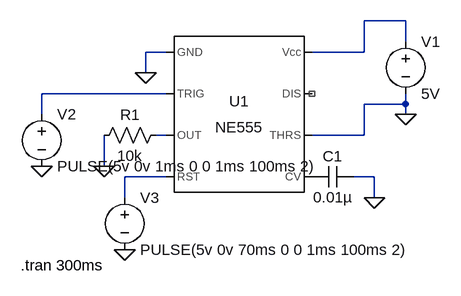
[diagram p0: schematic Bistable.asc]
Bistable.asc, the LTspice schematic file:
Version 4
SHEET 1 880 680
WIRE 480 32 416 32
WIRE 480 64 480 32
WIRE 112 80 80 80
WIRE 416 80 416 32
WIRE 416 80 336 80
WIRE 80 112 80 80
WIRE 112 144 -80 144
WIRE 480 160 480 144
WIRE 480 160 416 160
WIRE -80 176 -80 144
WIRE 480 176 480 160
WIRE 112 208 96 208
WIRE 416 208 416 160
WIRE 416 208 336 208
WIRE 16 256 16 208
WIRE 112 272 48 272
WIRE 432 272 400 272
WIRE 48 304 48 272
WIRE 432 304 432 272
FLAG 80 112 0
FLAG 480 176 0
FLAG -80 256 0
FLAG 48 384 0
FLAG 16 256 0
FLAG 432 304 0
SYMBOL Misc\\NE555 224 176 R0
SYMATTR InstName U1
SYMBOL voltage 480 48 R0
SYMATTR InstName V1
SYMATTR Value 5V
SYMBOL voltage -80 160 R0
WINDOW 123 0 0 Left 0
WINDOW 39 0 0 Left 0
SYMATTR InstName V2
SYMATTR Value PULSE(5v 0v 1ms 0 0 1ms 100ms 2)
SYMBOL voltage 48 288 R0
WINDOW 123 0 0 Left 0
WINDOW 39 0 0 Left 0
SYMATTR InstName V3
SYMATTR Value PULSE(5v 0v 70ms 0 0 1ms 100ms 2)
SYMBOL res 112 192 R90
WINDOW 0 0 56 VBottom 2
WINDOW 3 32 56 VTop 2
SYMATTR InstName R1
SYMATTR Value 10k
SYMBOL cap 400 256 R90
WINDOW 0 0 32 VBottom 2
WINDOW 3 32 32 VTop 2
SYMATTR InstName C1
SYMATTR Value 0.01µ
TEXT -112 408 Left 2 !.tran 300ms

The netlist it stands for:
* Bistable.asc
XU1 0 N002 N003 N004 P001 0 NC_01 N001 NE555  ; pins GND TRIG OUT RST CV THRS DIS Vcc
V1 N001 0 5V
V2 N002 0 PULSE(5v 0v 1ms 0 0 1ms 100ms 2)
V3 N004 0 PULSE(5v 0v 70ms 0 0 1ms 100ms 2)
R1 N003 0 10k
C1 0 P001 0.01µ
.tran 300ms
.lib NE555.sub
.backanno
.end